# EAGLE design v21 (EAGLE 9.6.2)
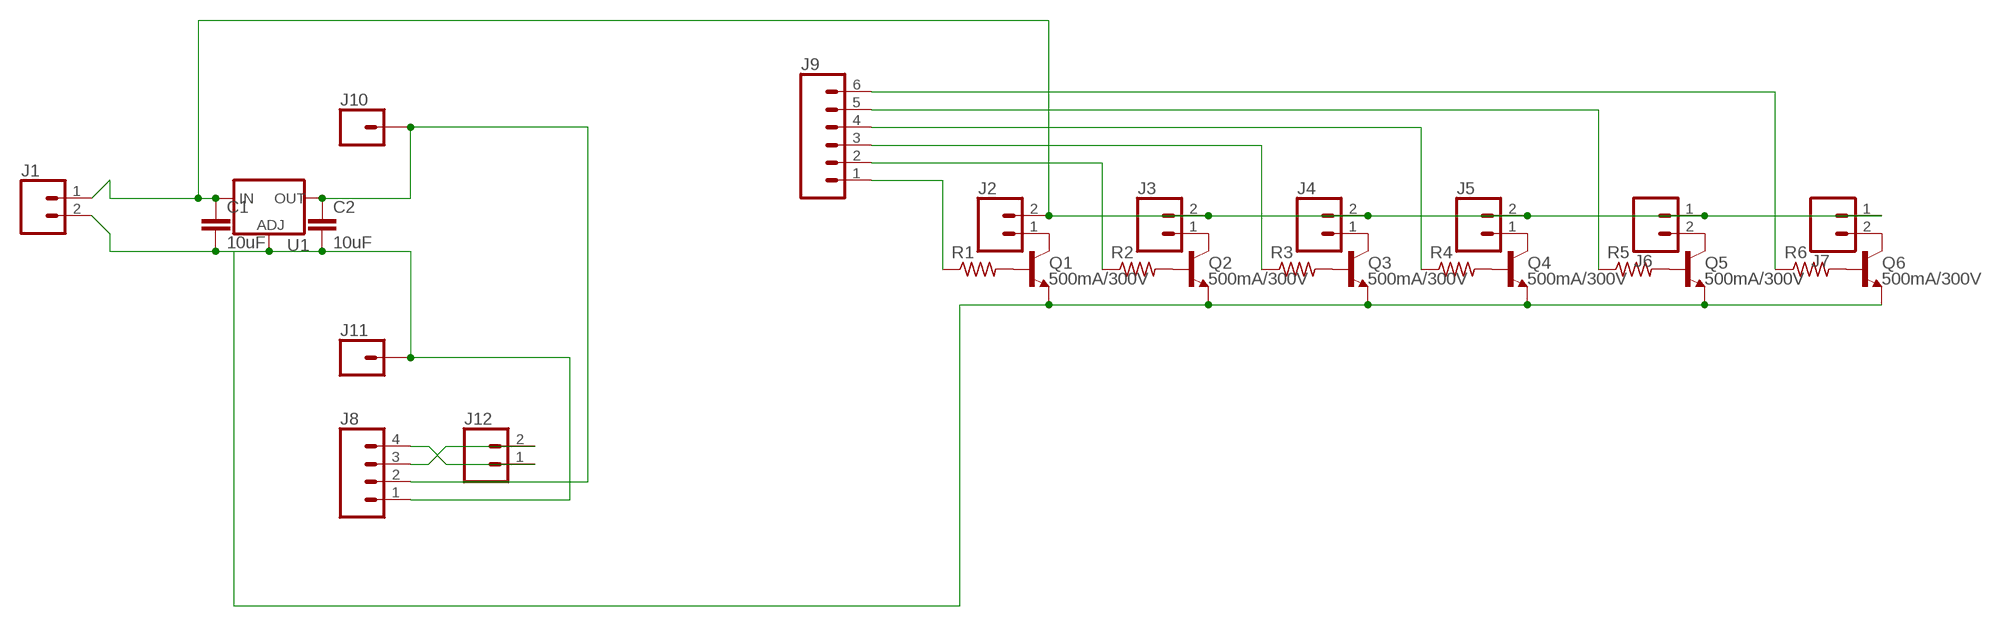
[diagram p0: schematic, sheet 1]

## Parts
C1  10uF  10UF-1206-6.3V-20%  [1206]
C2  10uF  10UF-1206-6.3V-20%  [1206]
J1  CONN_02-JST-2MM-SMT  [JST-2-SMD]
J2  CONN_02  [1X02]
J3  CONN_02  [1X02]
J4  CONN_02  [1X02]
J5  CONN_02  [1X02]
J6  CONN_02  [1X02]
J7  CONN_02  [1X02]
J8  CONN_04PTH  [1X04]
J9  CONN_06LONGPADS  [1X06_LONGPADS]
J10  CONN_01PTH_LONGPAD  [1X01_LONGPAD]
J11  CONN_01PTH_LONGPAD  [1X01_LONGPAD]
J12  CONN_02LOCK_LONGPADS  [1X02_LOCK_LONGPADS]
Q1  500mA/300V  TRANS_NPN-MMBTA42  [SOT23-3]
Q2  500mA/300V  TRANS_NPN-MMBTA42  [SOT23-3]
Q3  500mA/300V  TRANS_NPN-MMBTA42  [SOT23-3]
Q4  500mA/300V  TRANS_NPN-MMBTA42  [SOT23-3]
Q5  500mA/300V  TRANS_NPN-MMBTA42  [SOT23-3]
Q6  500mA/300V  TRANS_NPN-MMBTA42  [SOT23-3]
R1  R-US_R1206  [R1206]
R2  R-US_R1206  [R1206]
R3  R-US_R1206  [R1206]
R4  R-US_R1206  [R1206]
R5  R-US_R1206  [R1206]
R6  R-US_R1206  [R1206]
U1  V_REG_LM1117SOT223  [SOT223]

## Nets
N$1: J8.3 J12.2
N$2: C2.1 J8.2 J10.1 U1.2(OUT) U1.4(OUT)
N$4: J8.4 J12.1
N$5: J2.1 Q1.3(C)
N$6: Q1.1(B) R1.2
N$7: J3.1 Q2.3(C)
N$8: Q2.1(B) R2.2
N$9: J4.1 Q3.3(C)
N$10: Q3.1(B) R3.2
N$12: J9.1 R1.1
N$17: J5.1 Q4.3(C)
N$18: Q4.1(B) R4.2
N$19: J6.2 Q5.3(C)
N$20: Q5.1(B) R5.2
N$21: J7.2 Q6.3(C)
N$22: Q6.1(B) R6.2
N$24: C1.1 J1.1 J2.2 J3.2 J4.2 J5.2 J6.1 J7.1 U1.3(IN)
N$25: C1.2 C2.2 J1.2 J8.1 J11.1 Q1.2(E) Q2.2(E) Q3.2(E) Q4.2(E) Q5.2(E) Q6.2(E) U1.1(ADJ)
N$28: J9.2 R2.1
N$29: J9.3 R3.1
N$30: J9.4 R4.1
N$31: J9.5 R5.1
N$32: J9.6 R6.1

## Library data of the parts
C1 C2 = SparkFun-Capacitors:10UF: 10.0µF ceramic capacitors A capacitor is a passive two-terminal electrical component used to store electrical energy temporarily in an electric field.; PROD_ID: CAP-10057
J1 = SparkFun-Connectors:CONN_02: Multi connection point. Often used as Generic Header-pin footprint for 0.1 inch spaced/style header connections On any of the 0.1 inch spaced packages, you can populate with these: Break Away Headers - Straight <https://www.sparkfun.com/products/116> (PRT-00116) Break Away Male Headers - Right Angle <https://www.sparkfun.com/products/553> (PRT-00553) Female Headers <https://www.sparkfun.com/products/115> (PRT-00115) Break Away Headers - Machine Pin <https://www.sparkfun.com/products/117> (PRT-00117) Break Away Female Headers - Swiss Machine Pin <https://www.sparkfun.com/products/743> (PRT-00743) For SCREWTERMINALS and SPRING TERMINALS visit here: Screw Terimnals on SparkFun.com <https://www.sparkfun.com/search/results?term=Screw+Terminals> (5mm/3.5mm/2.54mm spacing) This device is also useful as a general connection point to wire up your design to another part of your project. Our various solder wires solder well into these plated through hole pads. Hook-Up Wire - Assortment (Stranded, 22 AWG) <https://www.sparkfun.com/products/11375> (PRT-11375) Hook-Up Wire - Assortment (Solid Core, 22 AWG) <https://www.sparkfun.com/products/11367> (PRT-11367) View the entire wire category on our website here <https://www.sparkfun.com/categories/141> Special notes: Molex polarized connector foot print use with: PRT-08233 with associated crimp pins and housings. 2.54_SCREWTERM for use with PRT-10571. 3.5mm Screw Terminal footprints for PRT-08084 5mm Screw Terminal footprints for use with PRT-08432; PROD_ID: CONN-11443
J2-J7 J12 = SparkFun-Connectors:CONN_02: Multi connection point. Often used as Generic Header-pin footprint for 0.1 inch spaced/style header connections On any of the 0.1 inch spaced packages, you can populate with these: Break Away Headers - Straight <https://www.sparkfun.com/products/116> (PRT-00116) Break Away Male Headers - Right Angle <https://www.sparkfun.com/products/553> (PRT-00553) Female Headers <https://www.sparkfun.com/products/115> (PRT-00115) Break Away Headers - Machine Pin <https://www.sparkfun.com/products/117> (PRT-00117) Break Away Female Headers - Swiss Machine Pin <https://www.sparkfun.com/products/743> (PRT-00743) For SCREWTERMINALS and SPRING TERMINALS visit here: Screw Terimnals on SparkFun.com <https://www.sparkfun.com/search/results?term=Screw+Terminals> (5mm/3.5mm/2.54mm spacing) This device is also useful as a general connection point to wire up your design to another part of your project. Our various solder wires solder well into these plated through hole pads. Hook-Up Wire - Assortment (Stranded, 22 AWG) <https://www.sparkfun.com/products/11375> (PRT-11375) Hook-Up Wire - Assortment (Solid Core, 22 AWG) <https://www.sparkfun.com/products/11367> (PRT-11367) View the entire wire category on our website here <https://www.sparkfun.com/categories/141> Special notes: Molex polarized connector foot print use with: PRT-08233 with associated crimp pins and housings. 2.54_SCREWTERM for use with PRT-10571. 3.5mm Screw Terminal footprints for PRT-08084 5mm Screw Terminal footprints for use with PRT-08432
J8 = SparkFun-Connectors:CONN_04: Multi connection point. Often used as Generic Header-pin footprint for 0.1 inch spaced/style header connections On any of the 0.1 inch spaced packages, you can populate with these: Break Away Headers - Straight <https://www.sparkfun.com/products/116> (PRT-00116) Break Away Male Headers - Right Angle <https://www.sparkfun.com/products/553> (PRT-00553) Female Headers <https://www.sparkfun.com/products/115> (PRT-00115) Break Away Headers - Machine Pin <https://www.sparkfun.com/products/117> (PRT-00117) Break Away Female Headers - Swiss Machine Pin <https://www.sparkfun.com/products/743> (PRT-00743) For SCREWTERMINALS and SPRING TERMINALS visit here: Screw Terimnals on SparkFun.com <https://www.sparkfun.com/search/results?term=Screw+Terminals> (5mm/3.5mm/2.54mm spacing) This device is also useful as a general connection point to wire up your design to another part of your project. Our various solder wires solder well into these plated through hole pads. Hook-Up Wire - Assortment (Stranded, 22 AWG) <https://www.sparkfun.com/products/11375> (PRT-11375) Hook-Up Wire - Assortment (Solid Core, 22 AWG) <https://www.sparkfun.com/products/11367> (PRT-11367) View the entire wire category on our website here <https://www.sparkfun.com/categories/141> Special notes: Molex polarized connector foot print use with SKU : PRT-08231 with associated crimp pins and housings. 1MM SMD Version SKU: PRT-10208; PROD_ID: CONN-09696
J9 = SparkFun-Connectors:CONN_06: Multi connection point. Often used as Generic Header-pin footprint for 0.1 inch spaced/style header connections On any of the 0.1 inch spaced packages, you can populate with these: Break Away Headers - Straight <https://www.sparkfun.com/products/116> (PRT-00116) Break Away Male Headers - Right Angle <https://www.sparkfun.com/products/553> (PRT-00553) Female Headers <https://www.sparkfun.com/products/115> (PRT-00115) Break Away Headers - Machine Pin <https://www.sparkfun.com/products/117> (PRT-00117) Break Away Female Headers - Swiss Machine Pin <https://www.sparkfun.com/products/743> (PRT-00743) Arduino Stackable Header - 6 Pin <https://www.sparkfun.com/products/9280> (PRT-09280) For SCREWTERMINALS and SPRING TERMINALS visit here: Screw Terimnals on SparkFun.com <https://www.sparkfun.com/search/results?term=Screw+Terminals> (5mm/3.5mm/2.54mm spacing) This device is also useful as a general connection point to wire up your design to another part of your project. Our various solder wires solder well into these plated through hole pads. Hook-Up Wire - Assortment (Stranded, 22 AWG) <https://www.sparkfun.com/products/11375> (PRT-11375) Hook-Up Wire - Assortment (Solid Core, 22 AWG) <https://www.sparkfun.com/products/11367> (PRT-11367) View the entire wire category on our website here <https://www.sparkfun.com/categories/141>
J10 J11 = SparkFun-Connectors:CONN_01: Single connection point. Often used as Generic Header-pin footprint for 0.1 inch spaced/style header connections On any of the 0.1 inch spaced packages, you can populate with these: Break Away Headers - Straight <https://www.sparkfun.com/products/116> (PRT-00116) Break Away Male Headers - Right Angle <https://www.sparkfun.com/products/553> (PRT-00553) Female Headers <https://www.sparkfun.com/products/115> (PRT-00115) Break Away Headers - Machine Pin <https://www.sparkfun.com/products/117> (PRT-00117) Break Away Female Headers - Swiss Machine Pin <https://www.sparkfun.com/products/743> (PRT-00743) This device is also useful as a general connection point to wire up your design to another part of your project. Our various solder wires solder well into these plated through hole pads. Hook-Up Wire - Assortment (Stranded, 22 AWG) <https://www.sparkfun.com/products/11375> (PRT-11375) Hook-Up Wire - Assortment (Solid Core, 22 AWG) <https://www.sparkfun.com/products/11367> (PRT-11367) View the entire wire category on our website here <https://www.sparkfun.com/categories/141> Special notes: SMTSO-256-ET is a "flush mount" nut for a 4-40 screw. We mostly use this on specialty testbeds; it is a nice way to connect hardware to your PCB at an adjustable hieght. Also note, the SNAP packages are for using a snappable style connector. We sell a baggie of snaps and they are also used on two LilyPad designs: Snap Assortment - 30 pack (male and female) <https://www.sparkfun.com/products/11347> (DEV-11347) LilyPad Arduino SimpleSnap <https://www.sparkfun.com/products/10941> (DEV-10941) LilyPad SimpleSnap Protoboard <https://www.sparkfun.com/products/10940> (DEV-10940)
Q1-Q6 = SparkFun-DiscreteSemi:TRANS_NPN: NPN transistor Current controlled devices typically used to amplify current or used as a switch. BC547 - COM-08928 <http://www.sparkfun.com/products/8928> (TO-92 45V 100mA) (1.Collector 2.Base 3.Emitter) 2N3904 - COM-00521 <http://www.sparkfun.com/products/521> (TO-92 40V 200mA) (1.Emitter 2.Base 3.Collector) P2N2222A - COM-12852 <http://www.sparkfun.com/products/12852> (TO-92 40V 600mA) (1.Collector 2.Base 3.Emitter); PROD_ID: TRANS-09116
R1-R6 = rcl:R-US_: RESISTOR, American symbol; SPICEPREFIX: R
U1 = SparkFun-IC-Power:V_REG_LM1117: Voltage Regulator LM1117 Standard adjustable voltage regulator but in SMD form. Spark Fun Electronics SKU : COM-00595; PROD_ID: VREG-08170

## Board
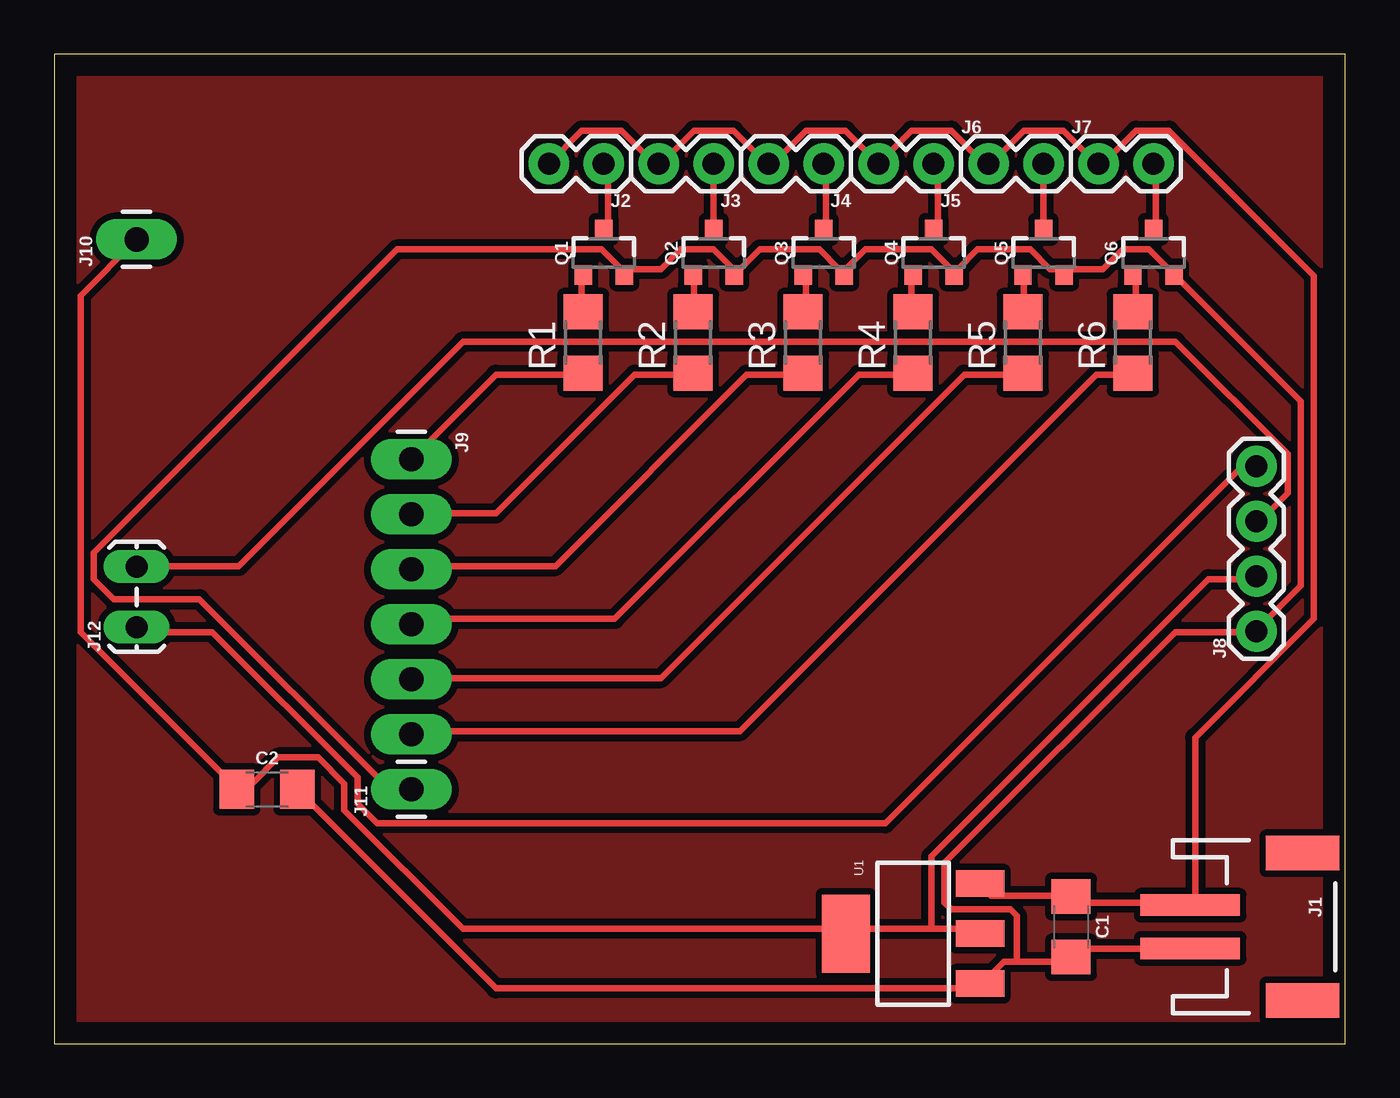
[diagram p1: board, top side]

Size 59.67 x 45.71 mm. Coordinates in mm from the lower left corner, seen from the top.
Outline: 0,0 59.67,0 59.67,45.71 0,45.71 0,0
Copper layers (1*16): Top 0.035mm / dielectric 1.5mm / Bottom 0.035mm
Design rules "default *": minimum track width 12mil, minimum drill 0.8mm, track to track 12mil, track to pad 12mil, pad to pad 12mil, via to via 12mil, smd to smd 12mil, copper to edge 40mil, drill to drill 6mil, minimum pad ring 10mil, minimum via ring 8mil, stop-mask expansion 4mil, vias tented up to drill 0mil, thermal gap 10mil

### Footprints (pad centres in the part's own frame; a part is rotated, then mirrored left to right if it is on the bottom)
1206 = smd 1.6 x 1.8: 1 -1.4,0; 2 1.4,0
JST-2-SMD = smd 1 x 4.6: 1 -1,-3.7; 2 1,-3.7 | smd 1.6 x 3.4: NC1 -3.4,1.5; NC2 3.4,1.5
1X02 = drill 1.016 pad 1.88: 1 0,0; 2 2.54,0
1X04 = drill 1.016 pad 1.88: 1 0,0; 2 2.54,0; 3 5.08,0; 4 7.62,0
1X06_LONGPADS = drill 1.118 pad 1.88 long: 1 0,0; 2 2.54,0; 3 5.08,0; 4 7.62,0; 5 10.16,0; 6 12.7,0
1X01_LONGPAD = drill 1.118 pad 1.88 long: 1 0,0
1X02_LOCK_LONGPADS = drill 1.016 long: 1 -0.127,0; 2 2.667,0
SOT23-3 = smd 0.8 x 0.9: 1 -0.95,-1; 2 0.95,-1; 3 0,1.1
R1206 = smd 1.6 x 1.803: 1 -1.422,0; 2 1.422,0
SOT223 = smd 1.219 x 2.235: 1 -2.311,-3.099; 2 0,-3.099; 3 2.311,-3.099 | smd 3.6 x 2.2: 4 0,3.099

### Placement (x,y rotation side)
C1  46.99,5.4 270 top
C2  9.84,11.75 0 top
J1  56.2,5.4 270 top
J2  25.4,40.64 180 top
J3  30.48,40.64 180 top
J4  35.56,40.64 180 top
J5  40.64,40.64 180 top
J6  43.18,40.64 0 top
J7  48.26,40.64 0 top
J8  55.56,19.05 90 top
J9  16.51,26.99 270 top
J10  3.81,37.15 90 top
J11  16.51,11.75 90 top
J12  3.81,19.37 90 top
Q1  25.4,36.51 0 top
Q2  30.48,36.51 0 top
Q3  35.56,36.51 0 top
Q4  40.64,36.51 0 top
Q5  45.72,36.51 0 top
Q6  50.8,36.51 0 top
R1  24.45,32.38 90 top
R2  29.53,32.38 90 top
R3  34.61,32.38 90 top
R4  39.69,32.38 90 top
R5  44.77,32.38 90 top
R6  49.85,32.38 90 top
U1  39.69,5.08 90 top

### Tracks (layer width: path | path; a pad name or v marks a point on that pad's centre or on a via)
GND
  pour Top: -0.32,46.35 60.01,46.35 60.01,-0.32 -0.32,-0.32
N$1
  Top 0.305: J12.2 3.96,22.06 8.53,22.06 18.9,32.42 51.82,32.42 57,27.24 57,25.41 55.78,24.19 J8.3
N$2
  Top 0.305: J10.1 1.22,34.56 1.22,19.01 8.23,12 C2.1 8.53,12 9.14,12 10.36,13.22 12.19,13.22 13.41,12 13.41,10.78 18.9,5.3 36.58,5.3 U1.4 36.88,5.3 40.54,5.3 | 40.54,5.3 42.67,5.3 U1.2 | 40.54,5.3 40.54,8.65 53.34,21.45 55.47,21.45 J8.2
N$4
  Top 0.305: J12.1 3.96,19.01 7.32,19.01 14.02,12.31 14.02,11.09 14.94,10.17 38.41,10.17 54.86,26.63 55.47,26.63 J8.4
N$5
  Top 0.305: Q1.3 25.6,37.91 25.6,40.35 J2.1
N$6
  Top 0.305: Q1.1 24.38,35.47 24.38,33.95 R1.2
N$7
  Top 0.305: J3.1 Q2.3
N$8
  Top 0.305: Q2.1 29.57,35.47 29.57,33.95 R2.2
N$9
  Top 0.305: Q3.3 35.66,37.91 35.66,40.35 J4.1
N$10
  Top 0.305: Q3.1 34.75,35.47 34.75,33.95 R3.2
N$12
  Top 0.305: J9.1 20.42,30.9 24.38,30.9 R1.1
N$17
  Top 0.305: Q4.3 40.84,37.91 40.84,40.35 J5.1
N$18
  Top 0.305: Q4.1 39.62,35.47 39.62,33.95 R4.2
N$19
  Top 0.305: J6.2 Q5.3
N$20
  Top 0.305: Q5.1 44.81,35.47 44.81,33.95 R5.2
N$21
  Top 0.305: Q6.3 50.9,37.91 50.9,40.35 J7.2
N$22
  Top 0.305: Q6.1 49.99,35.47 49.99,33.95 R6.2
N$24
  Top 0.305: U1.3 42.98,7.12 43.28,6.82 46.94,6.82 C1.1 47.24,6.52 52.43,6.52 J1.1 52.73,6.52 52.73,14.14 58.22,19.62 58.22,35.47 51.51,42.18 49.99,42.18 48.46,40.65 J7.1 48.16,40.65 46.63,42.18 44.81,42.18 43.28,40.65 J6.1 42.98,40.65 41.45,42.18 39.62,42.18 38.1,40.65 | J2.2 22.86,40.65 24.38,42.18 26.21,42.18 27.74,40.65 J3.2 28.04,40.65 29.57,42.18 31.39,42.18 32.92,40.65 J4.2 33.22,40.65 34.75,42.18 36.58,42.18 38.1,40.65 | 38.1,40.65 J5.2
N$25
  Top 0.305: C2.2 11.28,11.7 20.42,2.55 42.67,2.55 U1.1 42.98,2.86 43.89,3.77 44.5,3.77 | 44.5,3.77 46.94,3.77 C1.2 47.24,4.08 47.55,4.38 52.43,4.38 J1.2 | J11.1 16.46,12 15.24,12 6.71,20.54 2.74,20.54 1.83,21.45 1.83,22.67 15.85,36.69 25.3,36.69 26.21,35.78 Q1.2 26.52,35.78 28.04,35.78 28.96,36.69 30.48,36.69 31.39,35.78 Q2.2 31.7,35.78 32.61,36.69 35.36,36.69 36.27,35.78 Q3.2 36.58,35.78 37.49,36.69 40.54,36.69 41.45,35.78 Q4.2 41.76,35.78 42.67,36.69 45.11,36.69 46.02,35.78 46.63,35.78 Q5.2 46.94,35.78 48.46,35.78 49.38,36.69 50.6,36.69 51.51,35.78 Q6.2 51.82,35.47 57.61,29.68 57.61,21.15 55.78,19.32 J8.1 55.47,19.01 51.82,19.01 41.15,8.34 41.15,6.52 41.45,6.21 44.2,6.21 44.5,5.91 44.5,3.77
N$28
  Top 0.305: R2.1 29.26,30.9 26.82,30.9 20.42,24.5 16.76,24.5 J9.2
N$29
  Top 0.305: R3.1 34.44,30.9 32,30.9 23.16,22.06 16.76,22.06 J9.3
N$30
  Top 0.305: R4.1 39.62,30.9 37.19,30.9 25.91,19.62 16.76,19.62 J9.4
N$31
  Top 0.305: R5.1 44.5,30.9 42.06,30.9 28.04,16.88 16.76,16.88 J9.5
N$32
  Top 0.305: R6.1 49.68,30.9 48.16,30.9 31.7,14.44 16.76,14.44 J9.6